# Altium schematic sheet 05.SchDoc
size 539 x 379 mm
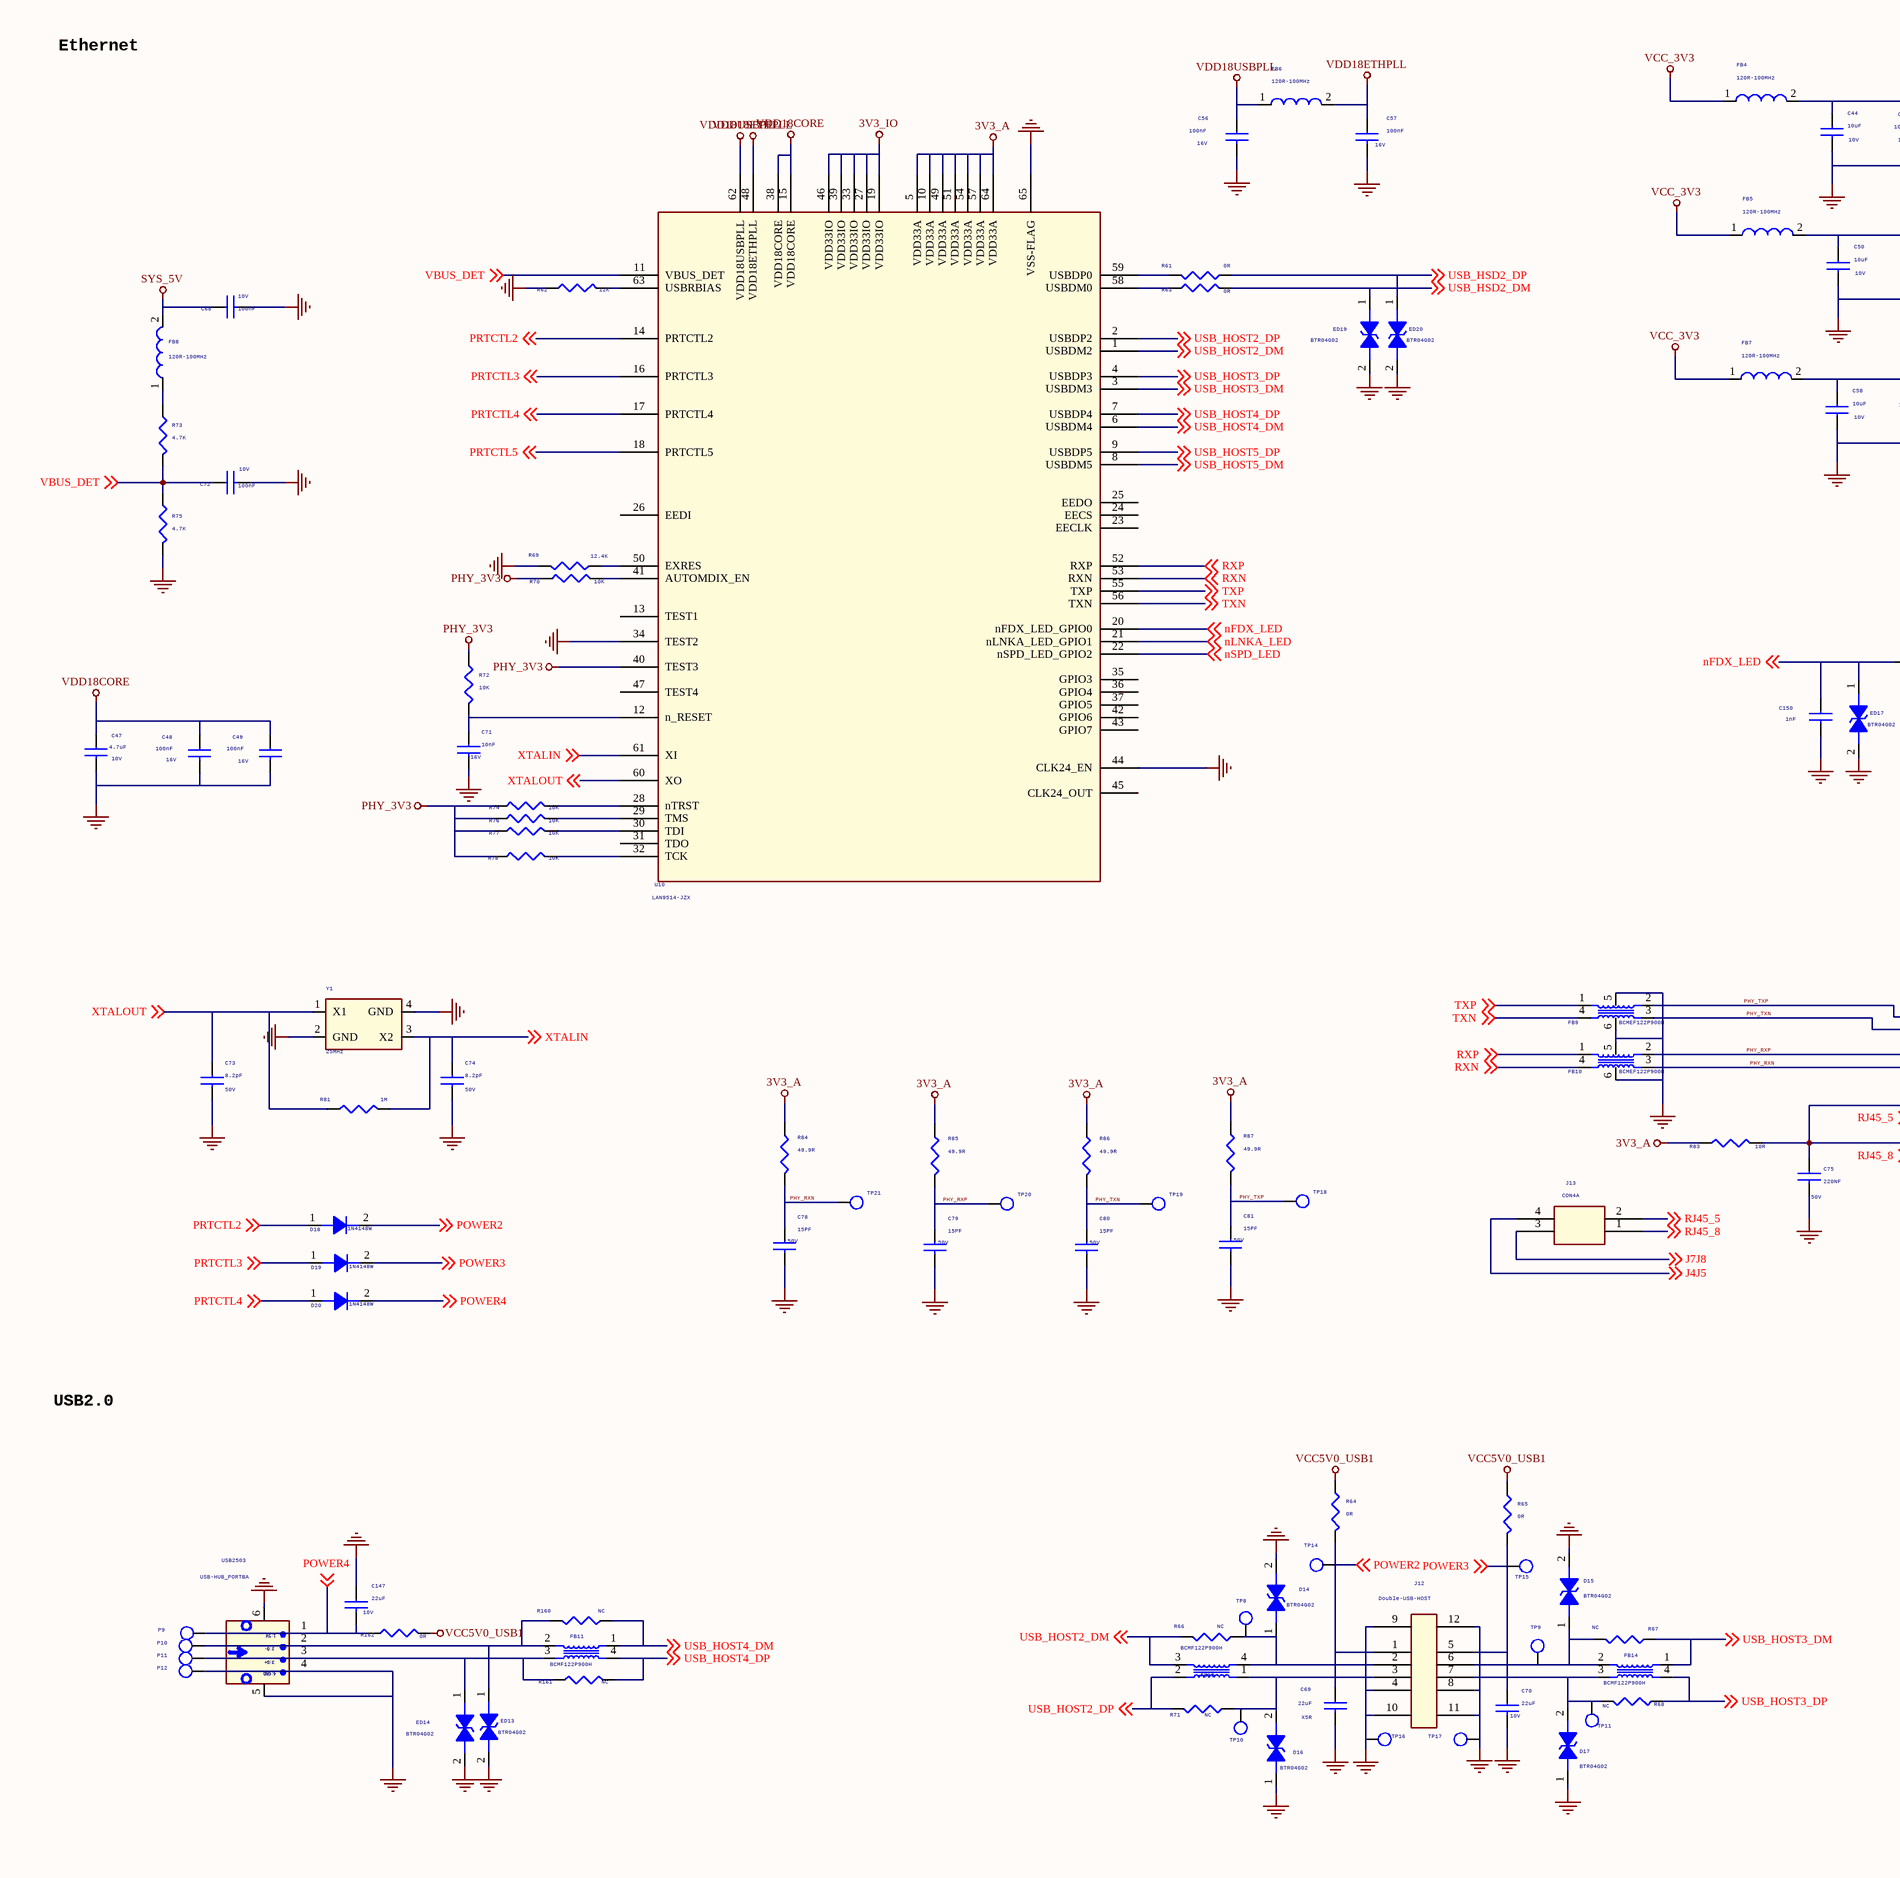
[diagram p0: 05.SchDoc, left]
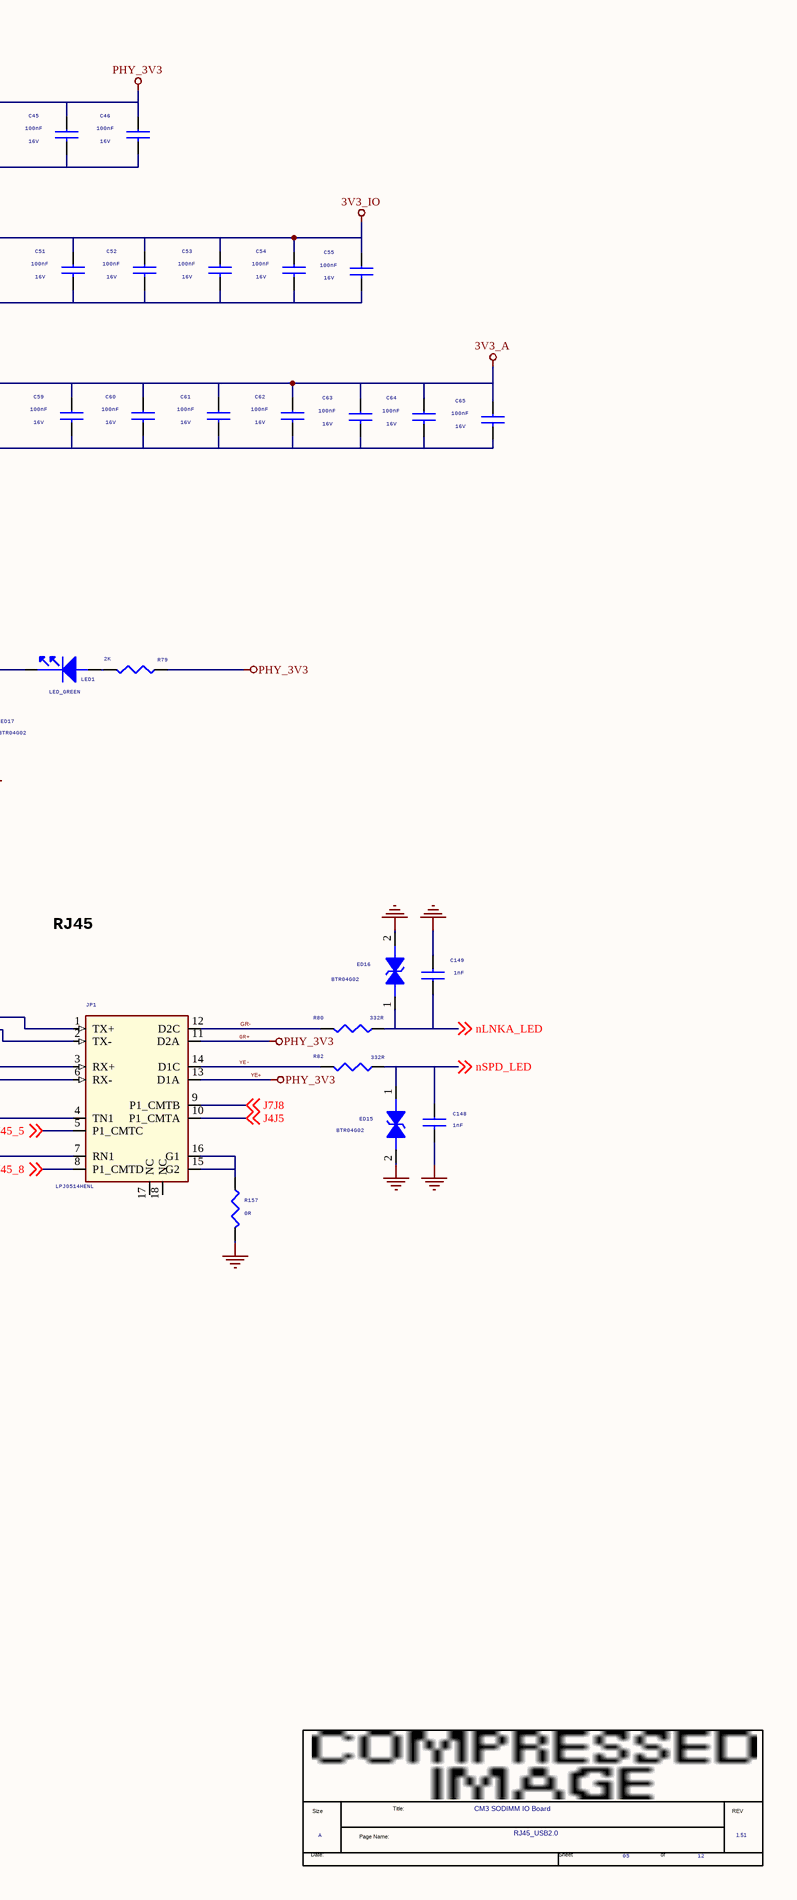
[diagram p1: 05.SchDoc, right]

## Parts
*  Page Count: 12  Page Number: 05  Page Size: A  Title: CM3 SODIMM IO Board  RevCode: 1.51  Doc: RJ45_USB2.0  (hidden comment: radxa_1010)  (graphical)
C44  10uF  Voltage: 10V  [C0603]
C45  100nF  Voltage: 16V  [C0402]
C46  100nF  Voltage: 16V  [C0402]
C47  4.7uF  Voltage: 10V  [C0603]
C48  100nF  Voltage: 16V  [C0402]
C49  100nF  Voltage: 16V  [C0402]
C50  10uF  Voltage: 10V  [C0603]
C51  100nF  Voltage: 16V  [C0402]
C52  100nF  Voltage: 16V  [C0402]
C53  100nF  Voltage: 16V  [C0402]
C54  100nF  Voltage: 16V  [C0402]
C55  100nF  Voltage: 16V  [C0402]
C56  100nF  Voltage: 16V  [C0402]
C57  100nF  Voltage: 16V  [C0402]
C58  10uF  Voltage: 10V  [C0603]
C59  100nF  Voltage: 16V  [C0402]
C60  100nF  Voltage: 16V  [C0402]
C61  100nF  Voltage: 16V  [C0402]
C62  100nF  Voltage: 16V  [C0402]
C63  100nF  Voltage: 16V  [C0402]
C64  100nF  Voltage: 16V  [C0402]
C65  100nF  Voltage: 16V  [C0402]
C68  100nF  Voltage: 10V  [C0402]
C69  22uF  Dielectric: X5R  [C0603]
C70  22uF  Voltage: 10V  [C0603]
C71  10nF  Voltage: 16V  [C0402]
C72  100nF  Voltage: 10V  [C0402]
C73  8.2pF  Voltage: 50V  [C0402]
C74  8.2pF  Voltage: 50V  [C0402]
C75  220NF  Voltage: 50V  [C0402]
C78  15PF  Voltage: 50V  [C0402]
C79  15PF  Voltage: 50V  [C0402]
C80  15PF  Voltage: 50V  [C0402]
C81  15PF  Voltage: 50V  [C0402]
C147  22uF  Voltage: 10V  [C0603]
C148  1nF  [C0402]
C149  1nF  [C0402]
C150  1nF  [C0402]
D14  BTR04G02  [ESD0402_1xD5]
D15  BTR04G02  [ESD0402_1xD5]
D16  BTR04G02  [ESD0402_1xD5]
D17  BTR04G02  [ESD0402_1xD5]
D18  1N4148W  [SOD_123]
D19  1N4148W  [SOD_123]
D20  1N4148W  [SOD_123]
ED13  BTR04G02  [ESD0402_1xD5]
ED14  BTR04G02  [ESD0402_1xD5]
ED15  BTR04G02  [ESD0402_1xD5]
ED16  BTR04G02  [ESD0402_1xD5]
ED17  BTR04G02  [ESD0402_1xD5]
ED19  BTR04G02  [ESD0402_1xD5]
ED20  BTR04G02  [ESD0402_1xD5]
FB4  120R-100MHz  [R0402]
FB5  120R-100MHz  [R0603]
FB6  120R-100MHz  [R0402]
FB7  120R-100MHz  [R0603]
FB8  120R-100MHz  [R0402]
FB9  BCMEF122P900H  [GMDG-6PIN_ESD]
FB10  BCMEF122P900H  [GMDG-6PIN_ESD]
FB11  BCMF122P900H  [GMDG-4PIN_ESD]
FB13  BCMF122P900H  [GMDG-4PIN_ESD]
FB14  BCMF122P900H  [GMDG-4PIN_ESD]
J12  Double-USB-HOST  [USB_DUAL]
J13  CON4A  [DIP4PIN-2_54MM-2X2]
JP1  LPJ0514HENL  [RJ45_CON8]
LED1  LED_GREEN  [LED0603]
P9  TEST  [TEST]  (value not drawn)
P10  TEST  [TEST]  (value not drawn)
P11  TEST  [TEST]  (value not drawn)
P12  TEST  [TEST]  (value not drawn)
R61  0R  [R0402]
R62  12K  [R0402]
R63  0R  [R0402]
R64  0R  [R0402]
R65  0R  [R0402]
R66  NC  [R0402]
R67  NC  [R0402]
R68  NC  [R0402]
R69  12.4K  [R0402]
R70  10K  [R0402]
R71  NC  [R0402]
R72  10K  [R0402]
R73  4.7K  [R0402]
R74  10K  [R0402]
R75  4.7K  [R0402]
R76  10K  [R0402]
R77  10K  [R0402]
R78  10K  [R0402]
R79  2K  [R0402]
R80  332R  [R0402]
R81  1M  [R0402]
R82  332R  [R0402]
R83  10R  [R0402]
R84  49.9R  [R0402]
R85  49.9R  [R0402]
R86  49.9R  [R0402]
R87  49.9R  [R0402]
R157  0R  [R0402]
R160  NC  [R0402]
R161  NC  [R0402]
R162  0R  [R0402]
TP8  TP_0.7  [TEST]  (value not drawn)
TP9  TP_0.7  [TEST]  (value not drawn)
TP10  TP_0.7  [TEST]  (value not drawn)
TP11  TP_0.7  [TEST]  (value not drawn)
TP14  TP_0.7  [TEST]  (value not drawn)
TP15  TP_0.7  [TEST]  (value not drawn)
TP16  TP_0.7  [TEST]  (value not drawn)
TP17  TP_0.7  [TEST]  (value not drawn)
TP18  TP_0.7  [TEST]  (value not drawn)
TP19  TP_0.7  [TEST]  (value not drawn)
TP20  TP_0.7  [TEST]  (value not drawn)
TP21  TP_0.7  [TEST]  (value not drawn)
U10  LAN9514-JZX  [QFN-64_9X9]
USB2503  USB-HUB_PORTBA  [USB20]
Y1  25MHz  [CRY-3225]

## Nets
3V3_A: C58.1 C59.1 C60.1 C61.1 C62.1 C63.1 C64.1 C65.1 FB7.2 R83.2 R84.1 R85.1 R86.1 R87.1 U10.5(VDD33A) U10.10(VDD33A) U10.49(VDD33A) U10.51(VDD33A) U10.54(VDD33A) U10.57(VDD33A) U10.64(VDD33A)
3V3_IO: C50.1 C51.1 C52.1 C53.1 C54.1 C55.1 FB5.2 U10.19(VDD33IO) U10.27(VDD33IO) U10.33(VDD33IO) U10.39(VDD33IO) U10.46(VDD33IO)
GND: C44.2 C45.2 C46.2 C47.2 C48.2 C49.2 C50.2 C51.2 C52.2 C53.2 C54.2 C55.2 C56.2 C57.2 C58.2 C59.2 C60.2 C61.2 C62.2 C63.2 C64.2 C65.2 C68.2 C69.2 C70.2 C71.2 C72.2 C73.2 C74.2 C75.2 C78.2 C79.2 C80.2 C81.2 C147.1 C148.2 C149.2 C150.2 D14.2 D15.2 D16.1 D17.1 ED13.2 ED14.2 ED15.2 ED16.2 ED17.2 ED19.2 ED20.2 FB9.5 FB9.6 FB10.5 FB10.6 J12.4 J12.8 J12.9 J12.10 J12.11 J12.12 P12.1 R62.2 R69.2 R75.2 R157.2 TP16.1 TP17.1 U10.34(TEST2) U10.44(CLK24_EN) U10.65(VSS-FLAG) USB2503.4 USB2503.5 USB2503.6 Y1.2(GND) Y1.4(GND)
GR+: C44.1 C45.1 C46.1 FB4.2 JP1.11(D2A) JP1.13(D1A) R70.2 R72.1 R74.2 R76.2 R77.2 R78.2 R79.1 U10.40(TEST3)  [also labelled PHY_3V3, YE+]
SYS_5V: C68.1 FB8.2
VCC5V0_USB1: R64.1 R65.1 R162.2
VCC_3V3: FB4.1 FB5.1 FB7.1
VDD18CORE: C47.1 C48.1 C49.1 U10.15(VDD18CORE) U10.38(VDD18CORE)
VDD18ETHPLL: C57.1 FB6.2 U10.48(VDD18ETHPLL)
VDD18USBPLL: C56.1 FB6.1 U10.62(VDD18USBPLL)
GR-: JP1.12(D2C) R80.2
J4J5: J13.4 JP1.10(P1_CMTA) ; off-sheet J4J5
J7J8: J13.3 JP1.9(P1_CMTB) ; off-sheet J7J8
nFDX_LED: C150.1 ED17.1 LED1.2(CATHODE) U10.20(nFDX_LED_GPIO0) ; off-sheet nFDX_LED
nLNKA_LED: C149.1 ED16.1 R80.1 U10.21(nLNKA_LED_GPIO1) ; off-sheet nLNKA_LED
nSPD_LED: C148.1 ED15.1 R82.1 U10.22(nSPD_LED_GPIO2) ; off-sheet nSPD_LED
PHY_RXN: C78.1 FB10.3(R3) JP1.6(RX-) R84.2 TP21.1
PHY_RXP: C79.1 FB10.2(R4) JP1.3(RX+) R85.2 TP20.1
PHY_TXN: C80.1 FB9.3(R3) JP1.2(TX-) R86.2 TP19.1
PHY_TXP: C81.1 FB9.2(R4) JP1.1(TX+) R87.2 TP18.1
POWER2: C69.1 D18.2(K) J12.1 R64.2 TP14.1 ; off-sheet POWER2
POWER3: C70.1 D19.2(K) J12.5 R65.2 TP15.1 ; off-sheet POWER3
POWER4: C147.2 D20.2(K) P9.1 R162.1 USB2503.1 ; off-sheet POWER4
PRTCTL2: D18.1(A) U10.14(PRTCTL2) ; off-sheet PRTCTL2
PRTCTL3: D19.1(A) U10.16(PRTCTL3) ; off-sheet PRTCTL3
PRTCTL4: D20.1(A) U10.17(PRTCTL4) ; off-sheet PRTCTL4
PRTCTL5: U10.18(PRTCTL5) ; off-sheet PRTCTL5
RJ45_5: J13.2 JP1.5(P1_CMTC) ; off-sheet RJ45_5
RJ45_8: J13.1 JP1.8(P1_CMTD) ; off-sheet RJ45_8
RXN: FB10.4(R2) U10.53(RXN) ; off-sheet RXN
RXP: FB10.1(R1) U10.52(RXP) ; off-sheet RXP
TXN: FB9.4(R2) U10.56(TXN) ; off-sheet TXN
TXP: FB9.1(R1) U10.55(TXP) ; off-sheet TXP
USB_HOST2_DM: FB13.3(R3) R66.2 U10.1(USBDM2) ; off-sheet USB_HOST2_DM
USB_HOST2_DP: FB13.2(R4) R71.2 U10.2(USBDP2) ; off-sheet USB_HOST2_DP
USB_HOST3_DM: FB14.1(R1) R67.2 U10.3(USBDM3) ; off-sheet USB_HOST3_DM
USB_HOST3_DP: FB14.4(R2) R68.2 U10.4(USBDP3) ; off-sheet USB_HOST3_DP
USB_HOST4_DM: FB11.1(R1) R160.1 U10.6(USBDM4) ; off-sheet USB_HOST4_DM
USB_HOST4_DP: FB11.4(R2) R161.1 U10.7(USBDP4) ; off-sheet USB_HOST4_DP
USB_HOST5_DM: U10.8(USBDM5) ; off-sheet USB_HOST5_DM
USB_HOST5_DP: U10.9(USBDP5) ; off-sheet USB_HOST5_DP
USB_HSD2_DM: ED19.1 R63.1 ; off-sheet USB_HSD2_DM
USB_HSD2_DP: ED20.1 R61.1 ; off-sheet USB_HSD2_DP
VBUS_DET: C72.1 R73.2 R75.1 U10.11(VBUS_DET) ; off-sheet VBUS_DET
XTALIN: C74.1 R81.2 U10.61(XI) Y1.3(X2) ; off-sheet XTALIN
XTALOUT: C73.1 R81.1 U10.60(XO) Y1.1(X1) ; off-sheet XTALOUT
YE-: JP1.14(D1C) R82.2
NetC71_1: C71.1 R72.2 U10.12(n_RESET)
NetC75_1: C75.1 JP1.4(TN1) JP1.7(RN1) R83.1
NetD14_1: D14.1 FB13.4(R2) J12.2 R66.1 TP8.1
NetD15_1: D15.1 FB14.2(R4) J12.6 R67.1 TP9.1
NetD16_2: D16.2 FB13.1(R1) J12.3 R71.1 TP10.1
NetD17_2: D17.2 FB14.3(R3) J12.7 R68.1 TP11.1
NetED13_1: ED13.1 FB11.2(R4) P10.1 R160.2 USB2503.2
NetED14_1: ED14.1 FB11.3(R3) P11.1 R161.2 USB2503.3
NetFB8_1: FB8.1 R73.1
NetJP1_15: JP1.15(G2) JP1.16(G1) R157.1
NetLED1_1: LED1.1(ANODE) R79.2
NetR61_2: R61.2 U10.59(USBDP0)
NetR62_1: R62.1 U10.63(USBRBIAS)
NetR63_2: R63.2 U10.58(USBDM0)
NetR69_1: R69.1 U10.50(EXRES)
NetR70_1: R70.1 U10.41(AUTOMDIX_EN)
NetR74_1: R74.1 U10.28(nTRST)
NetR76_1: R76.1 U10.29(TMS)
NetR77_1: R77.1 U10.30(TDI)
NetR78_1: R78.1 U10.32(TCK)

Not connected (* = marked no-connect by the designer): JP1 17(NC) 18(NC); U10 13(TEST1) 23(EECLK) 24(EECS) 25(EEDO) 26(EEDI) 31(TDO) 35(GPIO3) 36(GPIO4) 37(GPIO5) 42(GPIO6) 43(GPIO7) 45(CLK24_OUT) 47(TEST4)

## Notes on the sheet
- Ethernet
- RJ45
- USB2.0
- (in symbol radxa_1010) Size; Title:; REV; Page Name:; Date:; Sheet; of
- (in symbol USB20_TYPE_A) 1:5V; 2:D-; 3:D+; 4:GND

## Library data of the parts
C44 C50 C58 C147 = CAP NP_0: cap,10.00uF,+/-10%,10V,X5R,C0805; Manufacturer: TDK; RK PN: C2012X5R1A106K125AB; Priority: A; Tolerance: 10%; Dielectric: X5R; Part Type: C0805; Manufacturer PN: C2012X5R1A106K125AB; Created by: JJJ
C45 C48 C51 C53-C56 C59 C61-C65 C75 C78 C81 = CAP NP_0_Dup2: cap,100.00nF,+/-10%,16V,X5R,C0402; Manufacturer: TDK; RK PN: C1005X5R1C104K050BA; Priority: A; Tolerance: 10%; Dielectric: X5R; Part Type: C0402; Manufacturer PN: C1005X5R1C104K050BA; Created by: JJJ
C46 C49 C52 C57 C60 C71 C79 C80 = CAP NP_0_Dup2: cap,100.00nF,+/-10%,16V,X5R,C0402; Manufacturer PN: C1005X5R1C104K050BA; Manufacturer: TDK; Tolerance: 10%; Priority: A; Dielectric: X5R; Created by: JJJ; Part Type: C0402; RK PN: C1005X5R1C104K050BA
C47 = CAP NP_0: cap,10.00uF,+/-10%,10V,X5R,C0805; Manufacturer PN: C2012X5R1A106K125AB; Manufacturer: TDK; Tolerance: 10%; Priority: A; Dielectric: X5R; Created by: JJJ; Part Type: C0805; RK PN: C2012X5R1A106K125AB
C68 C72 = CAP NP_0: cap,1.00uF,+/-10%,10V,X5R,C0402; Manufacturer PN: C1005X5R1A105K050BB; Manufacturer: TDK; Tolerance: 10%; C_Voltage: 6.3V; Priority: A; Dielectric: X5R; Created by: JJJ; Part Type: C0402; RK PN: C1005X5R1A105K050BB
C69 C70 = CAP NP_0: cap,10.00uF,+/-10%,10V,X5R,C0603; Manufacturer PN: C1608X5R1A106K080AC; Manufacturer: TDK; Tolerance: 10%; Priority: A; Created by: JJJ; Part Type: C0603; RK PN: C1608X5R1A106K080AC
  C69: Voltage: 10V
  C70: Dielectric: X5R
C73 C74 = CAP NP_0: cap,18.00pF,+/-5%,50V,C0G,C0402; Manufacturer PN: C1005C0G1H180J050BA; Manufacturer: TDK; Tolerance: 5%; Priority: A; Dielectric: C0G; Created by: JJJ; Part Type: C0402; RK PN: C1005C0G1H180J050BA
C148 C150 = CAP NP_0_Dup2: cap,100.00nF,+/-10%,16V,X5R,C0402; Manufacturer PN: C1005X5R1C104K050BA; Manufacturer: TDK; Voltage: 50V; Tolerance: 10%; Priority: A; Dielectric: X5R; Created by: JJJ; Part Type: C0402; RK PN: C1005X5R1C104K050BA
C149 = CAP NP_0_Dup2: cap,100.00nF,+/-10%,16V,X5R,C0402; Manufacturer: TDK; Voltage: 50V; RK PN: C1005X5R1C104K050BA; Priority: A; Tolerance: 10%; Dielectric: X5R; Part Type: C0402; Manufacturer PN: C1005X5R1C104K050BA; Created by: JJJ
D14 D16 D17 = DIODE BI_DIR TRIG: 1-Line, Bi-directional, Transient Voltage Suppressors.17.5pF.; Manufacturer PN: ESD5451N; Manufacturer: WillSemi(韦尔半导体); OPTION: DNP; Priority: A; Created by: JJJ; Part Type: ESD_TVS; RK PN: ESD5451N
D15 = DIODE BI_DIR TRIG: 1-Line, Bi-directional, Transient Voltage Suppressors.17.5pF.; Manufacturer: WillSemi(韦尔半导体); RK PN: ESD5451N; Priority: A; OPTION: DNP; Part Type: ESD_TVS; Manufacturer PN: ESD5451N; Created by: JJJ
D18-D20 = DIODE_Dup1: Schottky Barrier，B5819WS SOD-323; Manufacturer: 长电; Priority: A; RK PN: B5819WS; Part Type: Schottky rectifier; Manufacturer PN: B5819WS; Created by: JJJ
ED13 ED15-ED17 ED19 ED20 = DIODE BI_DIR TRIG: 1-Line, Bi-directional, Transient Voltage Suppressors.17.5pF.; Manufacturer PN: ESD5451N; Manufacturer: WillSemi(韦尔半导体); Priority: A; Created by: JJJ; Part Type: ESD_TVS; RK PN: ESD5451N
ED14 = DIODE BI_DIR TRIG: 1-Line, Bi-directional, Transient Voltage Suppressors.17.5pF.; Manufacturer: WillSemi(韦尔半导体); RK PN: ESD5451N; Priority: A; Part Type: ESD_TVS; Manufacturer PN: ESD5451N; Created by: JJJ
FB4 FB8 = BEAD: BEAD,120R@100MHz,current=2000mA,0603; Manufacturer: Murata; Irms: 2A; Tolerance: 25%; DC Resistor: 0.030ohm; RK PN: BLM18KG121TN1; Priority: L; Part Type: BEAD; Manufacturer PN: BLM18KG121TN1; Created by: DZS
FB5-FB7 = BEAD: BEAD,120R@100MHz,current=2000mA,0603; Manufacturer PN: BLM18KG121TN1; Manufacturer: Murata; Irms: 2A; Tolerance: 25%; DC Resistor: 0.030ohm; Priority: L; Created by: DZS; Part Type: BEAD; RK PN: BLM18KG121TN1
FB9 FB10 = R-PACK4_0
FB11 FB13 FB14 = R-PACK4_3
J12 = CON4_0
J13 = CON4A_0
JP1 = RJ45_CON8_0
LED1 = LED: 贴片LED灯，0603，绿色; Priority: A; Created by: JJJ; Part Type: LED; RK PN: LED_GREEN
P9-P12 = TESTPOINT1
R61 R62 R67 R69 R70 R76-R78 R83 R161 = RESISTOR_0: 通用厚膜电阻,2R2,+/-5%,R0402,1/16W.; Manufacturer PN: RC0402JR-072R2L; Manufacturer: YAGEO; Tolerance: 5%; Wattage: 1/16W; Priority: A; Created by: YTL; Part Type: 通用厚膜电阻; RK PN: RC0402JR-072R2L
R63 R66 R68 R71 R74 R80 R82 R160 = RESISTOR_0: 通用厚膜电阻,2R2,+/-5%,R0402,1/16W.; Manufacturer: YAGEO; Tolerance: 5%; RK PN: RC0402JR-072R2L; Priority: A; Wattage: 1/16W; Part Type: 通用厚膜电阻; Manufacturer PN: RC0402JR-072R2L; Created by: YTL
R64 R72 R75 R84 R87 = RESISTOR_0: 通用厚膜电阻,4K7,+/-5%,R0402,1/16W.; Manufacturer PN: RC0402JR-074K7L; Manufacturer: YAGEO; Tolerance: 5%; Wattage: 1/16W; Priority: A; Created by: YTL; Part Type: 通用厚膜电阻; RK PN: RC0402JR-074K7L
R65 R73 R85 R86 R157 R162 = RESISTOR_0: 通用厚膜电阻,4K7,+/-5%,R0402,1/16W.; Manufacturer: YAGEO; Tolerance: 5%; RK PN: RC0402JR-074K7L; Priority: A; Wattage: 1/16W; Part Type: 通用厚膜电阻; Manufacturer PN: RC0402JR-074K7L; Created by: YTL
R79 = RESISTOR_0: 通用厚膜电阻,330R,+/-5%,R0402,1/16W.; Manufacturer: YAGEO; Tolerance: 5%; RK PN: RC0402JR-07330RL; Priority: A; Wattage: 1/16W; Part Type: 通用厚膜电阻; Manufacturer PN: RC0402JR-07330RL; Created by: YTL
R81 = RESISTOR_0: 通用厚膜电阻,0R,+/-5%,R0402,1/16W.; Manufacturer PN: RC0402JR-070RL; Manufacturer: YAGEO; Tolerance: 5%; Wattage: 1/16W; Priority: A; Option: DNP; Created by: YTL; Part Type: 通用厚膜电阻; RK PN: RC0402JR-070RL
TP8 TP9 TP11 TP14-TP17 = TP: Test Point 0.7mm; Priority: A; RK PN: TESTPOINT_0R7; Created by: JJJ; Part Type: TP
TP10 TP18-TP21 = TP: Test Point 0.7mm; RK PN: TESTPOINT_0R7; Priority: A; Part Type: TP; Created by: JJJ
U10 = CON15_2
USB2503 = USB20_TYPE_A: A型USB2.0座，卧式，插焊; Manufacturer: 旺科达; Priority: A; RK PN: USB-HOST_2.0; Created by: JJJ; Manufacturer Part Number: USB-HUB_PORTBA; Part Type: USB Jack
Y1 = CRYSTAL_4P: 无源晶振，25M，3225,±10ppm，10pF，Hosonic; Manufacturer PN: E3SB25.0000F10E11; Manufacturer: Hosonic(鸿星电子); Priority: A; Created by: JJJ; Part Type: CRYSTAL; RK PN: E3SB25.0000F10E11
* = radxa_1010: Page Create Date: March  8, 1995